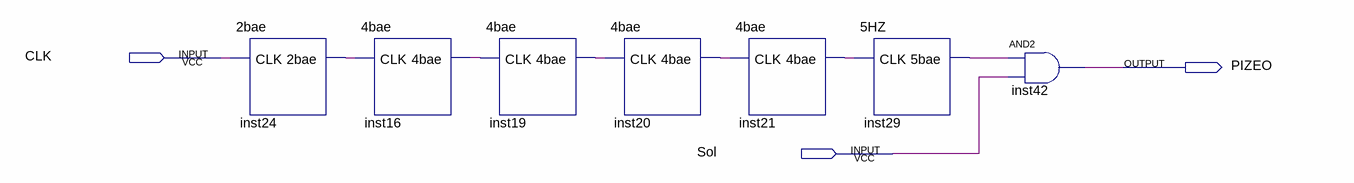
[diagram p0: schematic sheet]
// Quartus schematic Sol.bdf as structural Verilog: 7 symbols, 3 pins
module Sol (
  input  CLK,
  input  Sol,
  output PIZEO
);

  wire inst16_4bae, inst19_4bae, inst20_4bae, inst21_4bae, inst24_2bae, inst29_5bae;

  \2bae  inst24 (.CLK(CLK), .\2bae (inst24_2bae));
  \4bae  inst16 (.CLK(inst24_2bae), .\4bae (inst16_4bae));
  \4bae  inst19 (.CLK(inst16_4bae), .\4bae (inst19_4bae));
  \4bae  inst20 (.CLK(inst19_4bae), .\4bae (inst20_4bae));
  \4bae  inst21 (.CLK(inst20_4bae), .\4bae (inst21_4bae));
  \5HZ  inst29 (.CLK(inst21_4bae), .\5bae (inst29_5bae));
  and inst42 (PIZEO, inst29_5bae, Sol);
endmodule
